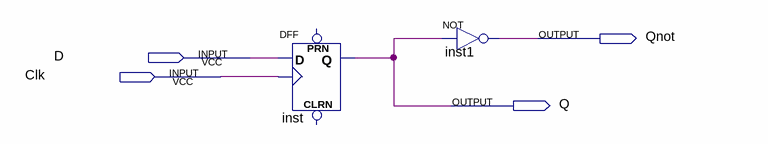
[diagram p0: schematic sheet]
// Quartus schematic dflipflop.bdf as structural Verilog: 2 symbols, 4 pins
module dflipflop (
  input  D,
  input  Clk,
  output Qnot,
  output Q
);

  DFF inst (.CLK(Clk), .D(D), .Q(Q));  // open: CLRN, PRN
  not inst1 (Qnot, Q);
endmodule
